# Altium schematic sheet power.SchDoc
size A3; DrawnBy: strawberryhacker; Email: strawberryhacker@outlook.com; Github: https://github.com/strawberryhacker; Year: 2021
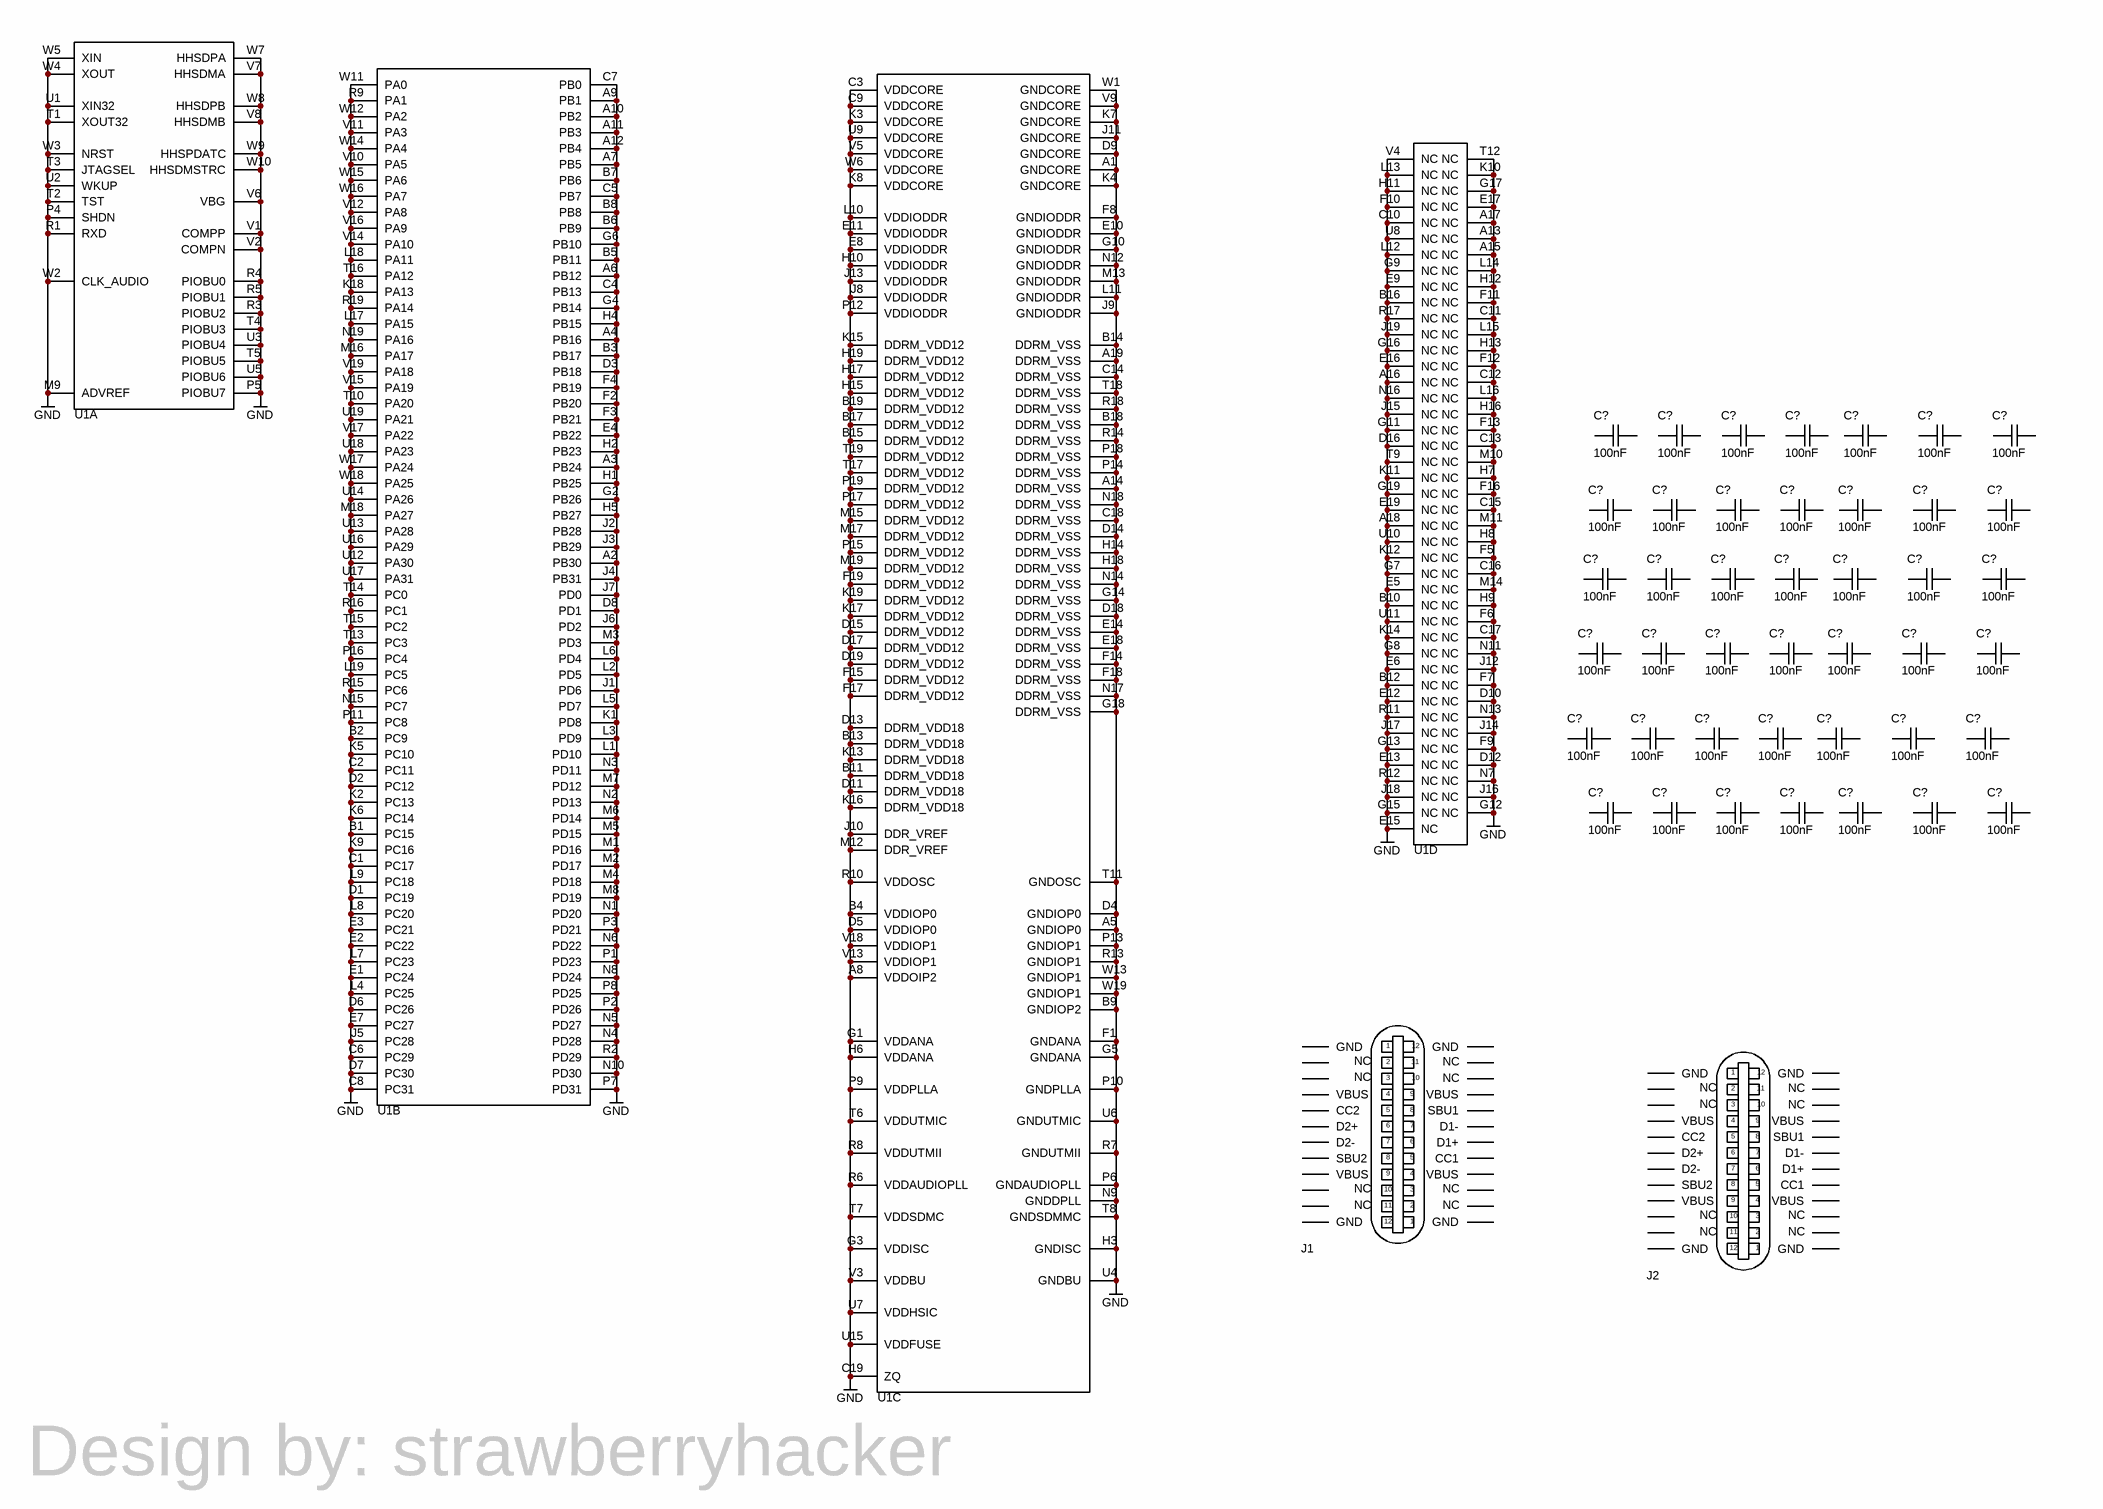
[diagram p0: power.SchDoc]

## Parts
(Parts that share a designator on the sheet are numbered #1, #2 ... from top to bottom, then left to right.)
C?#1  value 100nF  [capacitor 0402]  (hidden comment: passive_4)
C?#2  value 100nF  [capacitor 0402]  (hidden comment: passive_4)
C?#3  value 100nF  [capacitor 0402]  (hidden comment: passive_4)
C?#4  value 100nF  [capacitor 0402]  (hidden comment: passive_4)
C?#5  value 100nF  [capacitor 0402]  (hidden comment: passive_4)
C?#6  value 100nF  [capacitor 0402]  (hidden comment: passive_4)
C?#7  value 100nF  [capacitor 0402]  (hidden comment: passive_4)
C?#8  value 100nF  [capacitor 0402]  (hidden comment: passive_4)
C?#9  value 100nF  [capacitor 0402]  (hidden comment: passive_4)
C?#10  value 100nF  [capacitor 0402]  (hidden comment: passive_4)
C?#11  value 100nF  [capacitor 0402]  (hidden comment: passive_4)
C?#12  value 100nF  [capacitor 0402]  (hidden comment: passive_4)
C?#13  value 100nF  [capacitor 0402]  (hidden comment: passive_4)
C?#14  value 100nF  [capacitor 0402]  (hidden comment: passive_4)
C?#15  value 100nF  [capacitor 0402]  (hidden comment: passive_4)
C?#16  value 100nF  [capacitor 0402]  (hidden comment: passive_4)
C?#17  value 100nF  [capacitor 0402]  (hidden comment: passive_4)
C?#18  value 100nF  [capacitor 0402]  (hidden comment: passive_4)
C?#19  value 100nF  [capacitor 0402]  (hidden comment: passive_4)
C?#20  value 100nF  [capacitor 0402]  (hidden comment: passive_4)
C?#21  value 100nF  [capacitor 0402]  (hidden comment: passive_4)
C?#22  value 100nF  [capacitor 0402]  (hidden comment: passive_4)
C?#23  value 100nF  [capacitor 0402]  (hidden comment: passive_4)
C?#24  value 100nF  [capacitor 0402]  (hidden comment: passive_4)
C?#25  value 100nF  [capacitor 0402]  (hidden comment: passive_4)
C?#26  value 100nF  [capacitor 0402]  (hidden comment: passive_4)
C?#27  value 100nF  [capacitor 0402]  (hidden comment: passive_4)
C?#28  value 100nF  [capacitor 0402]  (hidden comment: passive_4)
C?#29  value 100nF  [capacitor 0402]  (hidden comment: passive_4)
C?#30  value 100nF  [capacitor 0402]  (hidden comment: passive_4)
C?#31  value 100nF  [capacitor 0402]  (hidden comment: passive_4)
C?#32  value 100nF  [capacitor 0402]  (hidden comment: passive_4)
C?#33  value 100nF  [capacitor 0402]  (hidden comment: passive_4)
C?#34  value 100nF  [capacitor 0402]  (hidden comment: passive_4)
C?#35  value 100nF  [capacitor 0402]  (hidden comment: passive_4)
C?#36  value 100nF  [capacitor 0402]  (hidden comment: passive_4)
C?#37  value 100nF  [capacitor 0402]  (hidden comment: passive_4)
C?#38  value 100nF  [capacitor 0402]  (hidden comment: passive_4)
C?#39  value 100nF  [capacitor 0402]  (hidden comment: passive_4)
C?#40  value 100nF  [capacitor 0402]  (hidden comment: passive_4)
C?#41  value 100nF  [capacitor 0402]  (hidden comment: passive_4)
C?#42  value 100nF  [capacitor 0402]  (hidden comment: passive_4)
J1  USB 2.0  [USB4105-GF-A]  (value not drawn)
J2  USB 2.0  [USB4105-GF-A]  (value not drawn)
U1  SAMA5D27 SiP  [ATSAMA5D27C-LD2G-CUR]  (value not drawn)  (parts A,B,C,D of 4)

## Nets
GND: U1.A1(GNDCORE) U1.A2(PB30) U1.A3(PB24) U1.A4(PB16) U1.A5(GNDIOP0) U1.A6(PB12) U1.A7(PB5) U1.A8(VDDOIP2) U1.A9(PB1) U1.A10(PB2) U1.A11(PB3) U1.A12(PB4) U1.A13(NC) U1.A14(DDRM_VSS) U1.A15(NC) U1.A16(NC) U1.A17(NC) U1.A18(NC) U1.A19(DDRM_VSS) U1.B1(PC15) U1.B2(PC9) U1.B3(PB17) U1.B4(VDDIOP0) U1.B5(PB11) U1.B6(PB9) U1.B7(PB6) U1.B8(PB8) U1.B9(GNDIOP2) U1.B10(NC) U1.B11(DDRM_VDD18) U1.B12(NC) U1.B13(DDRM_VDD18) U1.B14(DDRM_VSS) U1.B15(DDRM_VDD12) U1.B16(NC) U1.B17(DDRM_VDD12) U1.B18(DDRM_VSS) U1.B19(DDRM_VDD12) U1.C1(PC17) U1.C2(PC11) U1.C3(VDDCORE) U1.C4(PB13) U1.C5(PB7) U1.C6(PC29) U1.C7(PB0) U1.C8(PC31) U1.C9(VDDCORE) U1.C10(NC) U1.C11(NC) U1.C12(NC) U1.C13(NC) U1.C14(DDRM_VSS) U1.C15(NC) U1.C16(NC) U1.C17(NC) U1.C18(DDRM_VSS) U1.C19(ZQ) U1.D1(PC19) U1.D2(PC12) U1.D3(PB18) U1.D4(GNDIOP0) U1.D5(VDDIOP0) U1.D6(PC26) U1.D7(PC30) U1.D8(PD1) U1.D9(GNDCORE) U1.D10(NC) U1.D11(DDRM_VDD18) U1.D12(NC) U1.D13(DDRM_VDD18) U1.D14(DDRM_VSS) U1.D15(DDRM_VDD12) U1.D16(NC) U1.D17(DDRM_VDD12) U1.D18(DDRM_VSS) U1.D19(DDRM_VDD12) U1.E1(PC24) U1.E2(PC22) U1.E3(PC21) U1.E4(PB22) U1.E5(NC) U1.E6(NC) U1.E7(PC27) U1.E8(VDDIODDR) U1.E9(NC) U1.E10(GNDIODDR) U1.E11(VDDIODDR) U1.E12(NC) U1.E13(NC) U1.E14(DDRM_VSS) U1.E15(NC) U1.E16(NC) U1.E17(NC) U1.E18(DDRM_VSS) U1.E19(NC) U1.F1(GNDANA) U1.F2(PB20) U1.F3(PB21) U1.F4(PB19) U1.F5(NC) U1.F6(NC) U1.F7(NC) U1.F8(GNDIODDR) U1.F9(NC) U1.F10(NC) U1.F11(NC) U1.F12(NC) U1.F13(NC) U1.F14(DDRM_VSS) U1.F15(DDRM_VDD12) U1.F16(NC) U1.F17(DDRM_VDD12) U1.F18(DDRM_VSS) U1.F19(DDRM_VDD12) U1.G1(VDDANA) U1.G2(PB26) U1.G3(VDDISC) U1.G4(PB14) U1.G5(GNDANA) U1.G6(PB10) U1.G7(NC) U1.G8(NC) U1.G9(NC) U1.G10(GNDIODDR) U1.G11(NC) U1.G12(NC) U1.G13(NC) U1.G14(DDRM_VSS) U1.G15(NC) U1.G16(NC) U1.G17(NC) U1.G18(DDRM_VSS) U1.G19(NC) U1.H1(PB25) U1.H2(PB23) U1.H3(GNDISC) U1.H4(PB15) U1.H5(PB27) U1.H6(VDDANA) U1.H7(NC) U1.H8(NC) U1.H9(NC) U1.H10(VDDIODDR) U1.H11(NC) U1.H12(NC) U1.H13(NC) U1.H14(DDRM_VSS) U1.H15(DDRM_VDD12) U1.H16(NC) U1.H17(DDRM_VDD12) U1.H18(DDRM_VSS) U1.H19(DDRM_VDD12) U1.J1(PD6) U1.J2(PB28) U1.J3(PB29) U1.J4(PB31) U1.J5(PC28) U1.J6(PD2) U1.J7(PD0) U1.J8(VDDIODDR) U1.J9(GNDIODDR) U1.J10(DDR_VREF) U1.J11(GNDCORE) U1.J12(NC) U1.J13(VDDIODDR) U1.J14(NC) U1.J15(NC) U1.J16(NC) U1.J17(NC) U1.J18(NC) U1.J19(NC) U1.K1(PD8) U1.K2(PC13) U1.K3(VDDCORE) U1.K4(GNDCORE) U1.K5(PC10) U1.K6(PC14) U1.K7(GNDCORE) U1.K8(VDDCORE) U1.K9(PC16) U1.K10(NC) U1.K11(NC) U1.K12(NC) U1.K13(DDRM_VDD18) U1.K14(NC) U1.K15(DDRM_VDD12) U1.K16(DDRM_VDD18) U1.K17(DDRM_VDD12) U1.K18(PA13) U1.K19(DDRM_VDD12) U1.L1(PD10) U1.L2(PD5) U1.L3(PD9) U1.L4(PC25) U1.L5(PD7) U1.L6(PD4) U1.L7(PC23) U1.L8(PC20) U1.L9(PC18) U1.L10(VDDIODDR) U1.L11(GNDIODDR) U1.L12(NC) U1.L13(NC) U1.L14(NC) U1.L15(NC) U1.L16(NC) U1.L17(PA15) U1.L18(PA11) U1.L19(PC5) U1.M1(PD16) U1.M2(PD17) U1.M3(PD3) U1.M4(PD18) U1.M5(PD15) U1.M6(PD14) U1.M7(PD12) U1.M8(PD19) U1.M9(ADVREF) U1.M10(NC) U1.M11(NC) U1.M12(DDR_VREF) U1.M13(GNDIODDR) U1.M14(NC) U1.M15(DDRM_VDD12) U1.M16(PA17) U1.M17(DDRM_VDD12) U1.M18(PA27) U1.M19(DDRM_VDD12) U1.N1(PD20) U1.N2(PD13) U1.N3(PD11) U1.N4(PD28) U1.N5(PD27) U1.N6(PD22) U1.N7(NC) U1.N8(PD24) U1.N9(GNDDPLL) U1.N10(PD30) U1.N11(NC) U1.N12(GNDIODDR) U1.N13(NC) U1.N14(DDRM_VSS) U1.N15(PC7) U1.N16(NC) U1.N17(DDRM_VSS) U1.N18(DDRM_VSS) U1.N19(PA16) U1.P1(PD23) U1.P2(PD26) U1.P3(PD21) U1.P4(SHDN) U1.P5(PIOBU7) U1.P6(GNDAUDIOPLL) U1.P7(PD31) U1.P8(PD25) U1.P9(VDDPLLA) U1.P10(GNDPLLA) U1.P11(PC8) U1.P12(VDDIODDR) U1.P13(GNDIOP1) U1.P14(DDRM_VSS) U1.P15(DDRM_VDD12) U1.P16(PC4) U1.P17(DDRM_VDD12) U1.P18(DDRM_VSS) U1.P19(DDRM_VDD12) U1.R1(RXD) U1.R2(PD29) U1.R3(PIOBU2) U1.R4(PIOBU0) U1.R5(PIOBU1) U1.R6(VDDAUDIOPLL) U1.R7(GNDUTMII) U1.R8(VDDUTMII) U1.R9(PA1) U1.R10(VDDOSC) U1.R11(NC) U1.R12(NC) U1.R13(GNDIOP1) U1.R14(DDRM_VSS) U1.R15(PC6) U1.R16(PC1) U1.R17(NC) U1.R18(DDRM_VSS) U1.R19(PA14) U1.T1(XOUT32) U1.T2(TST) U1.T3(JTAGSEL) U1.T4(PIOBU3) U1.T5(PIOBU5) U1.T6(VDDUTMIC) U1.T7(VDDSDMC) U1.T8(GNDSDMMC) U1.T9(NC) U1.T10(PA20) U1.T11(GNDOSC) U1.T12(NC) U1.T13(PC3) U1.T14(PC0) U1.T15(PC2) U1.T16(PA12) U1.T17(DDRM_VDD12) U1.T18(DDRM_VSS) U1.T19(DDRM_VDD12) U1.U1(XIN32) U1.U2(WKUP) U1.U3(PIOBU4) U1.U4(GNDBU) U1.U5(PIOBU6) U1.U6(GNDUTMIC) U1.U7(VDDHSIC) U1.U8(NC) U1.U9(VDDCORE) U1.U10(NC) U1.U11(NC) U1.U12(PA30) U1.U13(PA28) U1.U14(PA26) U1.U15(VDDFUSE) U1.U16(PA29) U1.U17(PA31) U1.U18(PA23) U1.U19(PA21) U1.V1(COMPP) U1.V2(COMPN) U1.V3(VDDBU) U1.V4(NC) U1.V5(VDDCORE) U1.V6(VBG) U1.V7(HHSDMA) U1.V8(HHSDMB) U1.V9(GNDCORE) U1.V10(PA5) U1.V11(PA3) U1.V12(PA8) U1.V13(VDDIOP1) U1.V14(PA10) U1.V15(PA19) U1.V16(PA9) U1.V17(PA22) U1.V18(VDDIOP1) U1.V19(PA18) U1.W1(GNDCORE) U1.W2(CLK_AUDIO) U1.W3(NRST) U1.W4(XOUT) U1.W5(XIN) U1.W6(VDDCORE) U1.W7(HHSDPA) U1.W8(HHSDPB) U1.W9(HHSPDATC) U1.W10(HHSDMSTRC) U1.W11(PA0) U1.W12(PA2) U1.W13(GNDIOP1) U1.W14(PA4) U1.W15(PA6) U1.W16(PA7) U1.W17(PA24) U1.W18(PA25) U1.W19(GNDIOP1)

Not connected (* = marked no-connect by the designer): C?#1 1 2; C?#2 1 2; C?#3 1 2; C?#4 1 2; C?#5 1 2; C?#6 1 2; C?#7 1 2; C?#8 1 2; C?#9 1 2; C?#10 1 2; C?#11 1 2; C?#12 1 2; C?#13 1 2; C?#14 1 2; C?#15 1 2; C?#16 1 2; C?#17 1 2; C?#18 1 2; C?#19 1 2; C?#20 1 2; C?#21 1 2; C?#22 1 2; C?#23 1 2; C?#24 1 2; C?#25 1 2; C?#26 1 2; C?#27 1 2; C?#28 1 2; C?#29 1 2; C?#30 1 2; C?#31 1 2; C?#32 1 2; C?#33 1 2; C?#34 1 2; C?#35 1 2; C?#36 1 2; C?#37 1 2; C?#38 1 2; C?#39 1 2; C?#40 1 2; C?#41 1 2; C?#42 1 2; J1 A1_B12(GND) A4_B9(VBUS) A5(CC1) A6(D1+) A7(D1-) A8(SBU1) B1_A12(GND) B4_A9(VBUS) B5(CC2) B6(D2+) B7(D2-) B8(SBU2); J2 A1_B12(GND) A4_B9(VBUS) A5(CC1) A6(D1+) A7(D1-) A8(SBU1) B1_A12(GND) B4_A9(VBUS) B5(CC2) B6(D2+) B7(D2-) B8(SBU2)

## Notes on the sheet
- (in symbol connector_35) 1; 12; 2; 11; NC; 3; 10; 4; 9; 5; 8; 6; 7

## Library data of the parts
C?#1-C?#42 = passive_4: Capacitor 0402
J1 J2 = connector_35: USB C (2.0 only); Manufacturer 1: GCT; Supplier 1: Digi-Key; Supplier Part Number 1: 2073-USB4105-GF-ACT-ND; Manufacturer Part Number 1: USB4105-GF-A; Link: https://www.digikey.no/product-detail/no/gct/USB4105-GF-A/2073-USB4105-GF-ACT-ND/11198510
U1 = cpu_1: SAMA5D27 SiP, 500 MHz, 2Gb LPDDR2, 361 pins, BGA; Manufacturer 1: Microchip Technology; Supplier 1: Arrow Electronics; Supplier Part Number 1: ATSAMA5D27C-LD2G-CUR; Manufacturer Part Number 1: ATSAMA5D27C-LD2G-CUR; Link: https://www.arrow.com/en/products/atsama5d27c-ld2g-cur/microchip-technology?utm_term=instock&utm_currency=&utm_campaign=arrow_findchips_2021_Americas&utm_medium=aggregator&region=nac&utm_source=findchips&utm_content=inv_listing